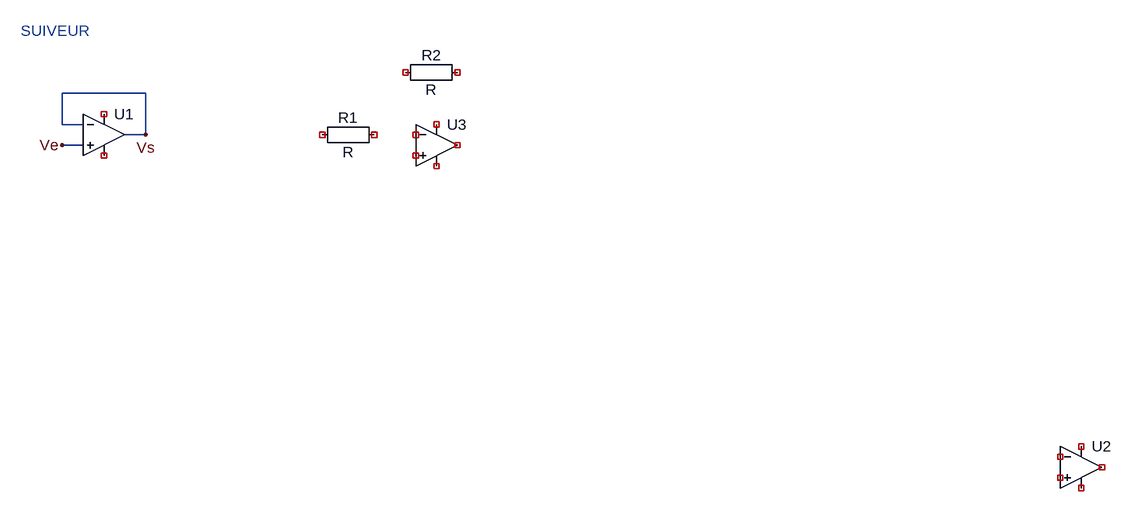
[diagram p0: schematic Draft2.asc]
Draft2.asc, the LTspice schematic file:
Version 4
SHEET 1 880 680
WIRE -912 -416 -1040 -416
WIRE -1040 -368 -1040 -416
WIRE -1008 -368 -1040 -368
WIRE -912 -352 -912 -416
WIRE -912 -352 -944 -352
WIRE -1008 -336 -1040 -336
FLAG -1040 -336 Ve
FLAG -912 -352 Vs
SYMBOL Opamps\\UniversalOpamp2 -976 -352 R0
SYMATTR InstName U1
SYMBOL Opamps\\UniversalOpamp2 528 160 R0
SYMATTR InstName U2
SYMBOL Opamps\\UniversalOpamp2 -464 -336 R0
SYMATTR InstName U3
SYMBOL Misc\\EuropeanResistor -544 -368 R90
WINDOW 0 5 56 VBottom 2
WINDOW 3 27 56 VTop 2
SYMATTR InstName R1
SYMBOL Misc\\EuropeanResistor -416 -464 R90
WINDOW 0 5 56 VBottom 2
WINDOW 3 27 56 VTop 2
SYMATTR InstName R2
TEXT -1104 -512 Left 2 ;SUIVEUR

The netlist it stands for:
* Draft2.asc
XU1 Ve Vs NC_01 NC_02 Vs level.2 Avol=1Meg GBW=10Meg Slew=10Meg ilimit=25m rail=0 Vos=0 phimargin=45 en=0 enk=0 in=0 ink=0 Rin=500Meg  ; pins IN+ IN- V+ V- OUT
XU2 NC_03 NC_04 NC_05 NC_06 NC_07 level.2 Avol=1Meg GBW=10Meg Slew=10Meg ilimit=25m rail=0 Vos=0 phimargin=45 en=0 enk=0 in=0 ink=0 Rin=500Meg  ; pins IN+ IN- V+ V- OUT
XU3 NC_08 NC_09 NC_10 NC_11 NC_12 level.2 Avol=1Meg GBW=10Meg Slew=10Meg ilimit=25m rail=0 Vos=0 phimargin=45 en=0 enk=0 in=0 ink=0 Rin=500Meg  ; pins IN+ IN- V+ V- OUT
R1 NC_13 NC_14 R
R2 NC_15 NC_16 R
* SUIVEUR
.lib UniversalOpamps2.sub
.backanno
.end